# EAGLE design workshop-atmega8 (EAGLE 6.3)
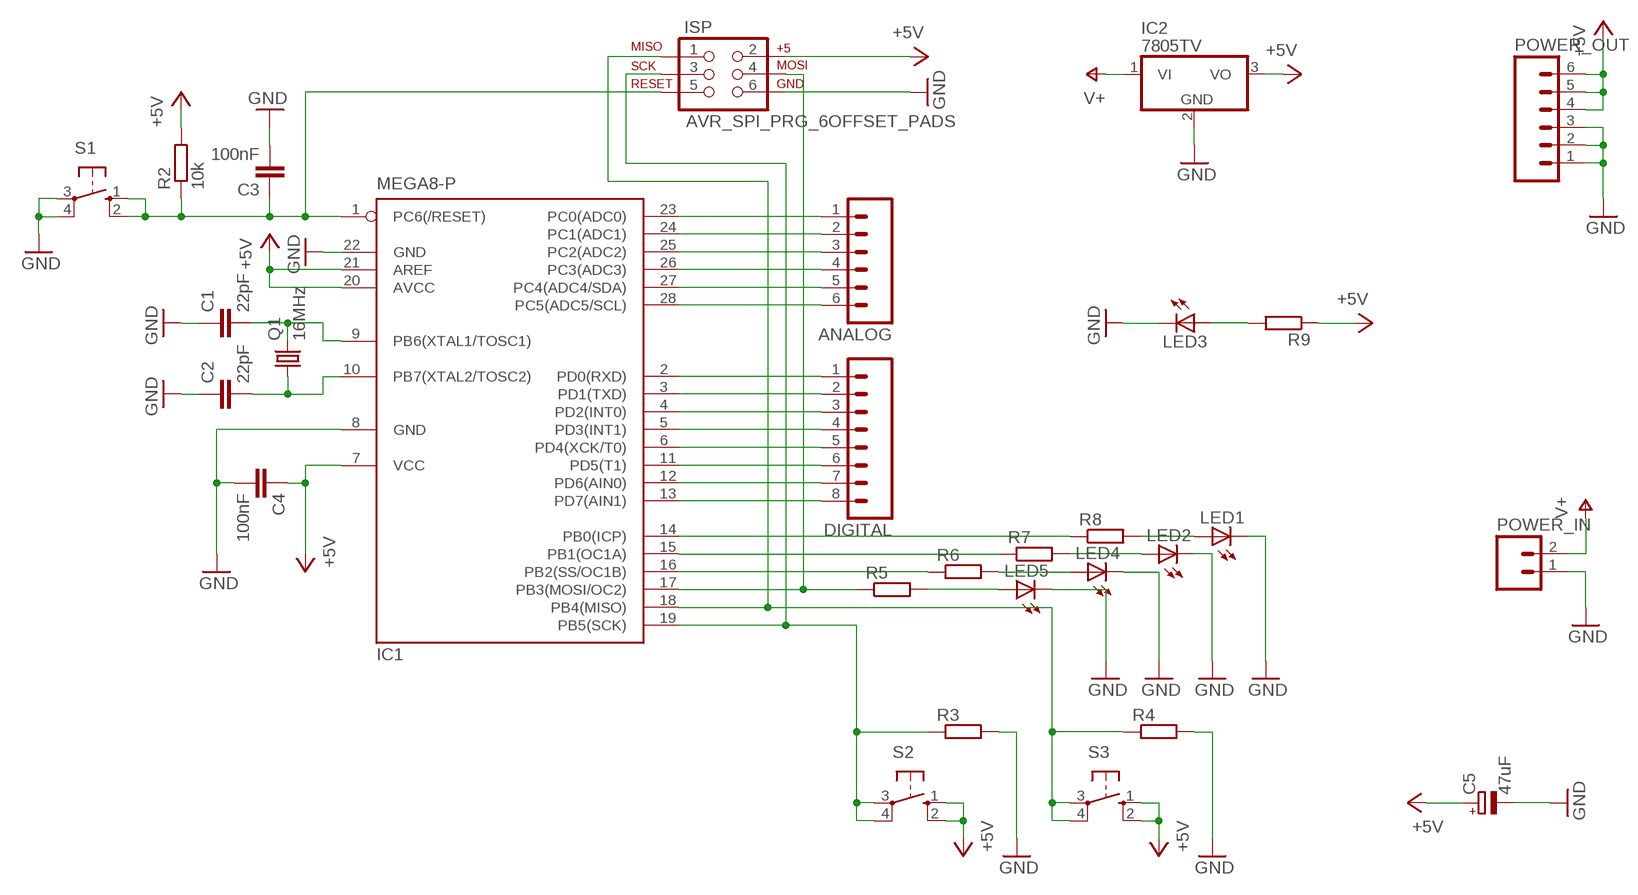
[diagram p0: schematic, sheet 1]

## Parts
ANALOG  M06LOCK_LONGPADS  [1X06_LOCK_LONGPADS]
C1  22pF  C-EU025-025X050  [C025-025X050]
C2  22pF  C-EU025-025X050  [C025-025X050]
C3  100nF  C-EU025-025X050  [C025-025X050]
C4  100nF  C-EU025-025X050  [C025-025X050]
C5  47uF  CPOL-EUE2.5-7  [E2,5-7]
DIGITAL  M08LOCK_LONGPADS  [1X08_LOCK_LONGPADS]
IC1  MEGA8-P  [DIL28-3]
IC2  7805TV  [TO220V]
ISP  AVR_SPI_PRG_6OFFSET_PADS  [2X3_OFFSET]
LED1  LED5MM  [LED5MM]
LED2  LED5MM  [LED5MM]
LED3  LED5MM  [LED5MM]
LED4  LED5MM  [LED5MM]
LED5  LED5MM  [LED5MM]
POWER_IN  M02LOCK_LONGPADS  [1X02_LOCK_LONGPADS]
POWER_OUT  M06LOCK_LONGPADS  [1X06_LOCK_LONGPADS]
Q1  16MHz  CRYSTALHC49S  [HC49/S]
R2  10k  R-EU_0207/10  [0207/10]
R3  R-EU_0207/10  [0207/10]
R4  R-EU_0207/10  [0207/10]
R5  R-EU_0207/10  [0207/10]
R6  R-EU_0207/10  [0207/10]
R7  R-EU_0207/10  [0207/10]
R8  R-EU_0207/10  [0207/10]
R9  R-EU_0207/10  [0207/10]
S1  10-XX  [B3F-10XX]
S2  10-XX  [B3F-10XX]
S3  10-XX  [B3F-10XX]

## Nets
+5V: C4.1 C5.+ IC1.7(VCC) IC1.20(AVCC) IC1.21(AREF) IC2.3(VO) ISP.2 POWER_OUT.4 POWER_OUT.5 POWER_OUT.6 R2.2 R9.1 S2.1(S) S2.2(S1) S3.1(S) S3.2(S1)
GND: C1.1 C2.1 C3.2 C4.2 C5.- IC1.8(GND) IC1.22(GND) IC2.2(GND) ISP.6 LED1.K(C) LED2.K(C) LED3.K(C) LED4.K(C) LED5.K(C) POWER_IN.1 POWER_OUT.1 POWER_OUT.2 POWER_OUT.3 R3.2 R4.2 S1.3(P) S1.4(P1)
N$1: C1.2 IC1.9(PB6(XTAL1/TOSC1)) Q1.2
N$2: C2.2 IC1.10(PB7(XTAL2/TOSC2)) Q1.1
N$3: C3.1 IC1.1(PC6(/RESET)) ISP.5 R2.1 S1.1(S) S1.2(S1)
N$5: IC1.17(PB3(MOSI/OC2)) ISP.4 R5.1
N$6: LED3.A R9.2
N$7: LED1.A R8.2
N$8: ANALOG.1 IC1.23(PC0(ADC0))
N$9: ANALOG.2 IC1.24(PC1(ADC1))
N$10: ANALOG.3 IC1.25(PC2(ADC2))
N$11: ANALOG.4 IC1.26(PC3(ADC3))
N$12: ANALOG.5 IC1.27(PC4(ADC4/SDA))
N$13: ANALOG.6 IC1.28(PC5(ADC5/SCL))
N$14: LED2.A R7.2
N$15: IC1.18(PB4(MISO)) ISP.1 R4.1 S3.3(P) S3.4(P1)
N$16: IC1.15(PB1(OC1A)) R7.1
N$17: IC1.14(PB0(ICP)) R8.1
N$18: LED4.A R6.2
N$19: DIGITAL.1 IC1.2(PD0(RXD))
N$20: LED5.A R5.2
N$21: DIGITAL.2 IC1.3(PD1(TXD))
N$23: IC1.19(PB5(SCK)) ISP.3 R3.1 S2.3(P) S2.4(P1)
N$24: DIGITAL.3 IC1.4(PD2(INT0))
N$25: DIGITAL.4 IC1.5(PD3(INT1))
N$26: DIGITAL.5 IC1.6(PD4(XCK/T0))
N$27: DIGITAL.6 IC1.11(PD5(T1))
N$28: DIGITAL.7 IC1.12(PD6(AIN0))
N$29: DIGITAL.8 IC1.13(PD7(AIN1))
N$32: IC1.16(PB2(SS/OC1B)) R6.1
V+: IC2.1(VI) POWER_IN.2

## Library data of the parts
ANALOG POWER_OUT = SparkFun:M06: Header 6 Standard 6-pin 0.1" header. Use with straight break away headers (SKU : PRT-00116), right angle break away headers (PRT-00553), swiss pins (PRT-00743), machine pins (PRT-00117), and female headers (PRT-00115). Molex polarized connector foot print use with SKU : PRT-08094 with associated crimp pins and housings. NOTES ON THE VARIANTS LOCK and LOCK_LONGPADS... This footprint was designed to help hold the alignment of a through-hole component (i.e. 6-pin header) while soldering it into place. You may notice that each hole has been shifted either up or down by 0.005 of an inch from it's more standard position (which is a perfectly straight line). This slight alteration caused the pins (the squares in the middle) to touch the edges of the holes. Because they are alternating, it causes a "brace" to hold the component in place. 0.005 has proven to be the perfect amount of "off-center" position when using our standard breakaway headers. Although looks a little odd when you look at the bare footprint, once you have a header in there, the alteration is very hard to notice. Also, if you push a header all the way into place, it is covered up entirely on the bottom side. This idea of altering the position of holes to aid alignment will be further integrated into the Sparkfun Library for other footprints. It can help hold any component with 3 or more connection pins.
C1-C4 = rcl:C-EU: CAPACITOR, European symbol
C5 = rcl:CPOL-EU: POLARIZED CAPACITOR, European symbol
DIGITAL = SparkFun:M08: Header 8 Standard 8-pin 0.1" header. Use with straight break away headers (SKU : PRT-00116), right angle break away headers (PRT-00553), swiss pins (PRT-00743), machine pins (PRT-00117), and female headers (PRT-00115).
IC1 = atmel:MEGA8-P: MICROCONTROLLER 8 Kbytes FLASH, 1 kbytes SRAM, 512 bytes EEPROM, USART, 4-channel 10 bit ADC, 2-channel 8 bit ADC Pin compatible with Atmega48, ATMega88, ATMega168 Source: avr.lbr; OC_FARNELL: unknown; OC_NEWARK: unknown
IC2 = linear:78*: Positive VOLTAGE REGULATOR Source: http://cache.national.com/ds/LM/LM78L05.pdf http://www.fairchildsemi.com/ds/LM/LM7805.pdf
ISP = SparkFun:AVR_SPI_PRG_6: AVR ISP 6 Pin This is the reduced ISP connector for AVR programming. Common on Arduino. This footprint will take up less PCB space and can be used with a 10-pin to 6-pin adapter such as SKU: BOB-08508
LED1-LED5 = led:LED: LED OSRAM: - CHIPLED LG R971, LG N971, LY N971, LG Q971, LY Q971, LO R971, LY R971 LH N974, LH R974 LS Q976, LO Q976, LY Q976 LO Q996 - Hyper CHIPLED LW Q18S LB Q993, LB Q99A, LB R99A - SideLED LS A670, LO A670, LY A670, LG A670, LP A670 LB A673, LV A673, LT A673, LW A673 LH A674 LY A675 LS A676, LA A676, LO A676, LY A676, LW A676 LS A679, LY A679, LG A679 - Hyper Micro SIDELED® LS Y876, LA Y876, LO Y876, LY Y876 LT Y87S - SmartLED LW L88C, LW L88S LB L89C, LB L89S, LG L890 LS L89K, LO L89K, LY L89K LS L896, LA L896, LO L896, LY L896 - TOPLED LS T670, LO T670, LY T670, LG T670, LP T670 LSG T670, LSP T670, LSY T670, LOP T670, LYG T670 LG T671, LOG T671, LSG T671 LB T673, LV T673, LT T673, LW T673 LH T674 LS T676, LA T676, LO T676, LY T676, LB T676, LH T676, LSB T676, LW T676 LB T67C, LV T67C, LT T67C, LS T67K, LO T67K, LY T67K, LW E67C LS E67B, LA E67B, LO E67B, LY E67B, LB E67C, LV E67C, LT E67C LW T67C LS T679, LY T679, LG T679 LS T770, LO T770, LY T770, LG T770, LP T770 LB T773, LV T773, LT T773, LW T773 LH T774 LS E675, LA E675, LY E675, LS T675 LS T776, LA T776, LO T776, LY T776, LB T776 LHGB T686 LT T68C, LB T68C - Hyper Mini TOPLED® LB M676 - Mini TOPLED Santana® LG M470 LS M47K, LO M47K, LY M47K Source: http://www.osram.convergy.de LUXEON: - LUMILED® LXK2-PW12-R00, LXK2-PW12-S00, LXK2-PW14-U00, LXK2-PW14-V00 LXK2-PM12-R00, LXK2-PM12-S00, LXK2-PM14-U00 LXK2-PE12-Q00, LXK2-PE12-R00, LXK2-PE12-S00, LXK2-PE14-T00, LXK2-PE14-U00 LXK2-PB12-K00, LXK2-PB12-L00, LXK2-PB12-M00, LXK2-PB14-N00, LXK2-PB14-P00, LXK2-PB14-Q00 LXK2-PR12-L00, LXK2-PR12-M00, LXK2-PR14-Q00, LXK2-PR14-R00 LXK2-PD12-Q00, LXK2-PD12-R00, LXK2-PD12-S00 LXK2-PH12-R00, LXK2-PH12-S00 LXK2-PL12-P00, LXK2-PL12-Q00, LXK2-PL12-R00 Source: www.luxeon.com KINGBRIGHT: KA-3528ASYC Source: www.kingbright.com
POWER_IN = SparkFun:M02: Header 2 Standard 2-pin 0.1" header. Use with straight break away headers (SKU : PRT-00116), right angle break away headers (PRT-00553), swiss pins (PRT-00743), machine pins (PRT-00117), and female headers (PRT-00115). Molex polarized connector foot print use with SKU : PRT-08233 with associated crimp pins and housings.
Q1 = crystal:CRYSTAL: CRYSTAL; OC_FARNELL: 1667008; OC_NEWARK: unknown
R2-R9 = rcl:R-EU_: RESISTOR, European symbol
S1-S3 = switch-omron:10-XX: OMRON SWITCH; MPN: B3F-1000; OC_FARNELL: 176432; OC_NEWARK: 36M3542

## Board
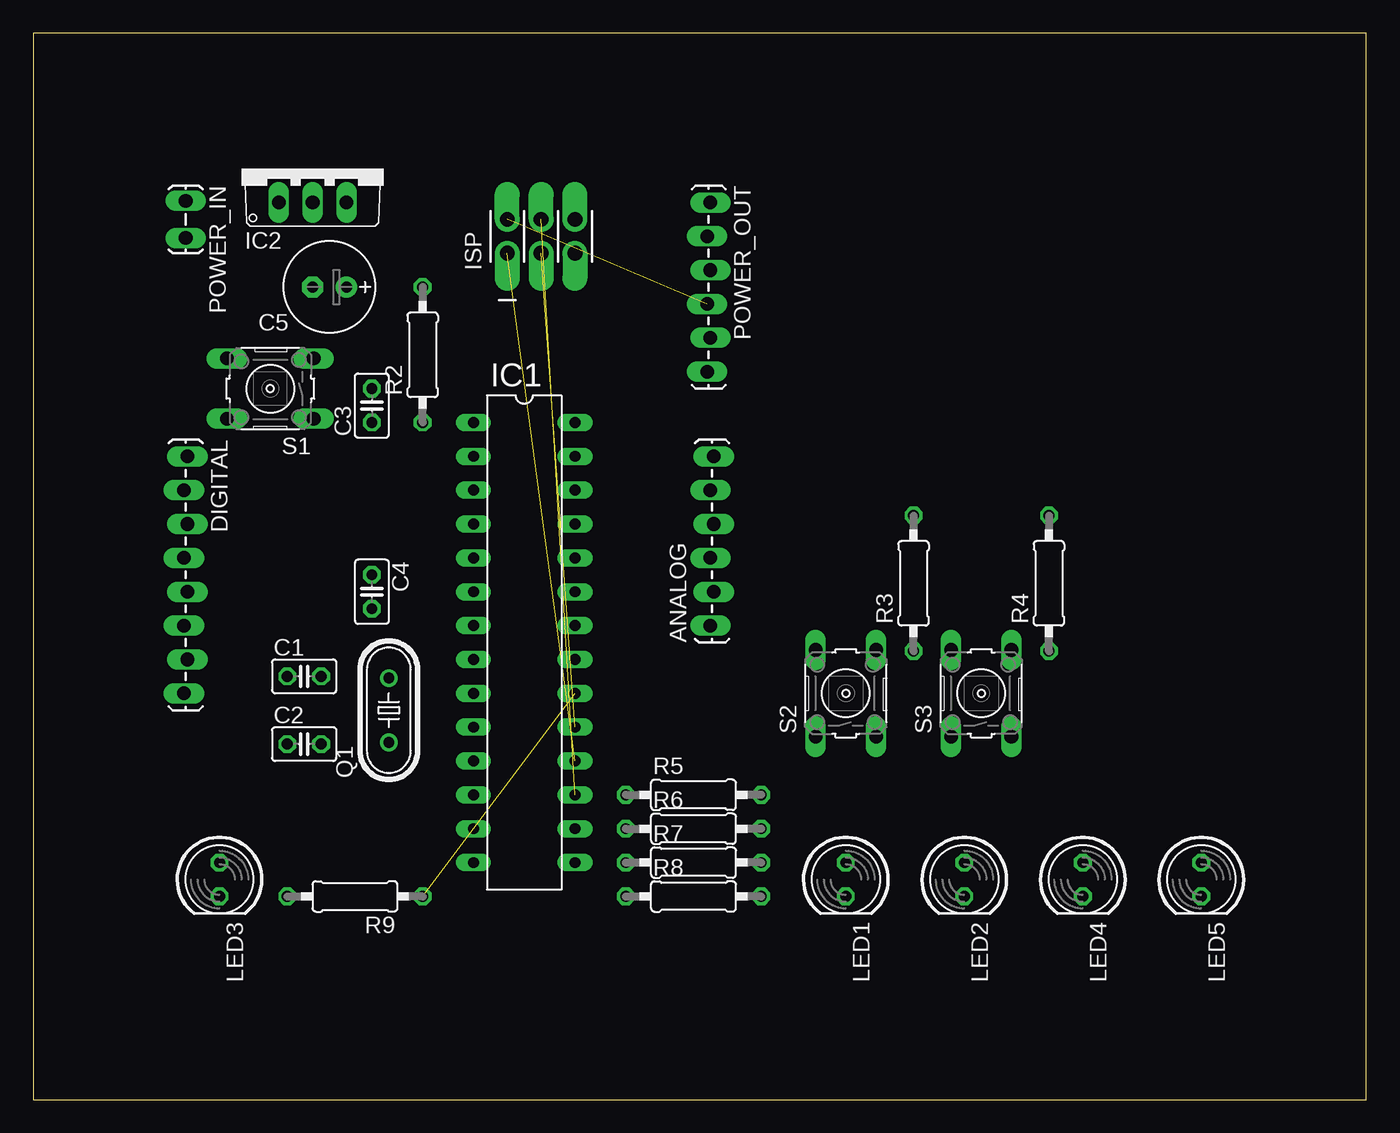
[diagram p1: board, top side]
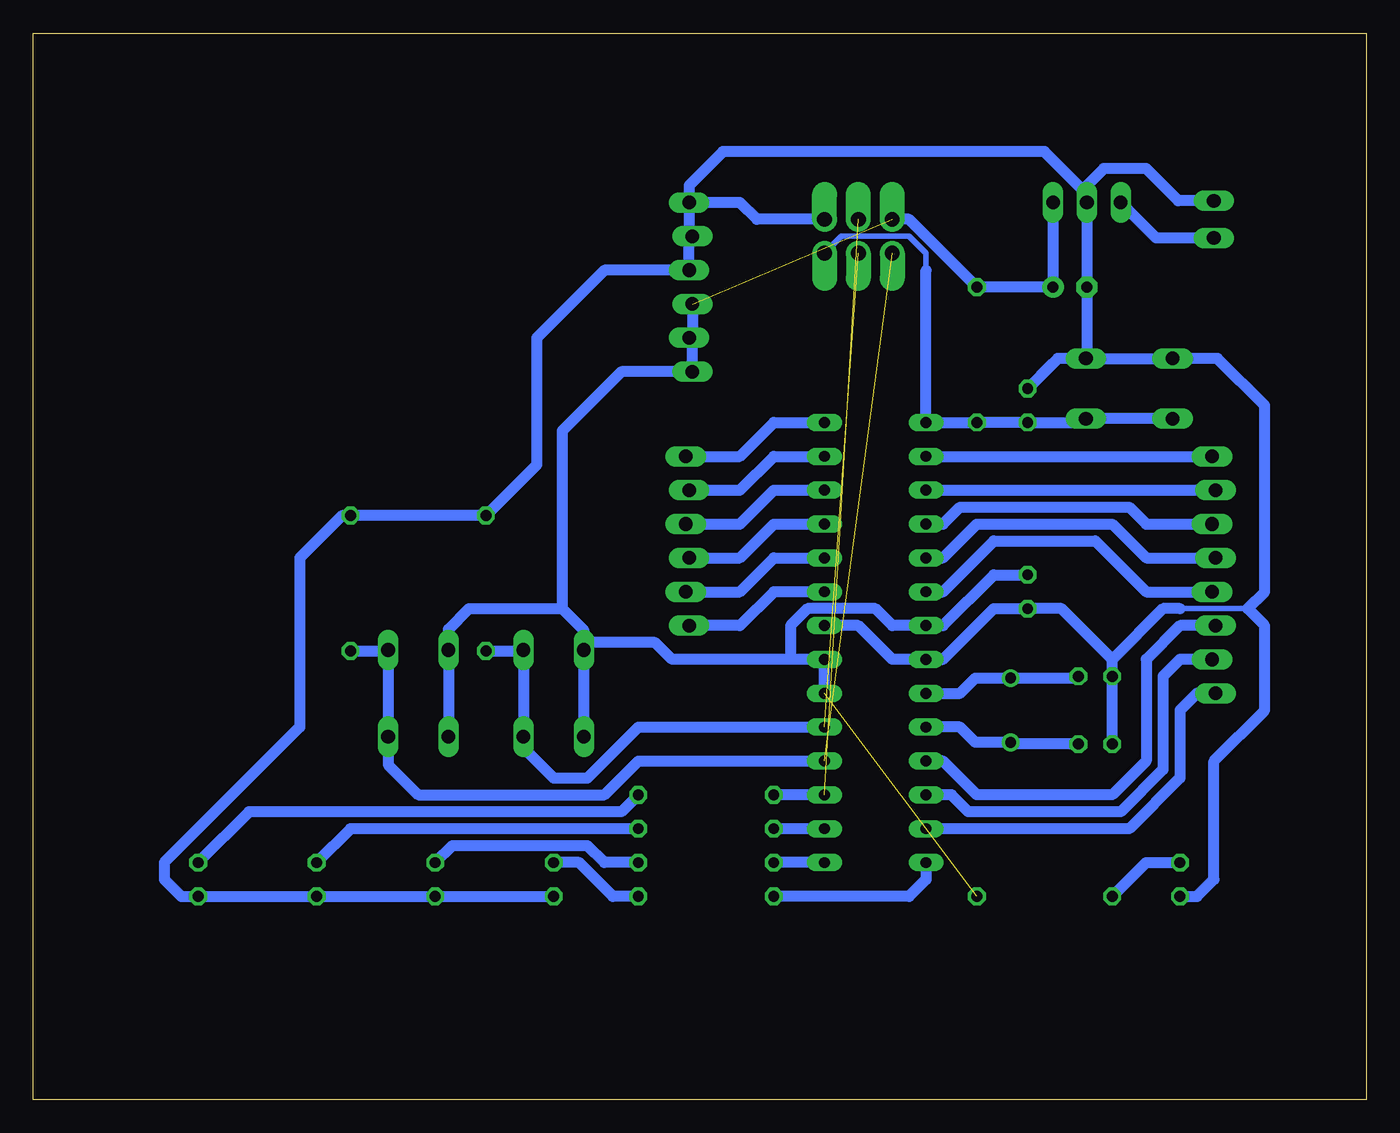
[diagram p2: board, bottom side, seen from below]

Size 100 x 80 mm. Coordinates in mm from the lower left corner, seen from the top.
Outline: 0,0 100,0 100,80 0,80 0,0
Copper layers (1*16): Top 0.035mm / dielectric 1.5mm / Bottom 0.035mm
Design rules "default": minimum track width 10mil, minimum drill 24mil, track to track 8mil, track to pad 8mil, pad to pad 8mil, via to via 8mil, smd to smd 8mil, copper to edge 40mil, drill to drill 8mil, minimum pad ring 10mil, minimum via ring 8mil, stop-mask expansion 4mil, vias tented up to drill 0mil, thermal gap 10mil

### Footprints (pad centres in the part's own frame; a part is rotated, then mirrored left to right if it is on the bottom)
1X06_LOCK_LONGPADS = drill 1.016 long: 1 0,0; 2 2.54,-0.254; 3 5.08,0; 4 7.62,-0.254; 5 10.16,0; 6 12.7,-0.254
C025-025X050 = drill 0.813 octagon: 1 -1.27,0; 2 1.27,0
E2,5-7 = drill 0.813 pad 1.6: + -1.27,0 | drill 0.813 pad 1.6 octagon: - 1.27,0
1X08_LOCK_LONGPADS = drill 1.016 long: 1 0,0.127; 2 2.54,-0.127; 3 5.08,0.127; 4 7.62,-0.127; 5 10.16,0.127; 6 12.7,-0.127; 7 15.24,0.127; 8 17.78,-0.127
DIL28-3 = drill 0.813 long: 1 -16.51,-3.81; 2 -13.97,-3.81; 3 -11.43,-3.81; 4 -8.89,-3.81; 5 -6.35,-3.81; 6 -3.81,-3.81; 7 -1.27,-3.81; 8 1.27,-3.81; 9 3.81,-3.81; 10 6.35,-3.81; 11 8.89,-3.81; 12 11.43,-3.81; 13 13.97,-3.81; 14 16.51,-3.81; 15 16.51,3.81; 16 13.97,3.81; 17 11.43,3.81; 18 8.89,3.81; 19 6.35,3.81; 20 3.81,3.81; 21 1.27,3.81; 22 -1.27,3.81; 23 -3.81,3.81; 24 -6.35,3.81; 25 -8.89,3.81; 26 -11.43,3.81; 27 -13.97,3.81; 28 -16.51,3.81
TO220V = drill 1.016 long: 1 -2.54,-2.54; 2 0,-2.54; 3 2.54,-2.54
2X3_OFFSET = drill 1.118 pad 1.88 offset: 1 -2.54,-1.27; 2 -2.54,1.27; 3 0,-1.27; 4 0,1.27; 5 2.54,-1.27; 6 2.54,1.27
LED5MM = drill 0.813 octagon: A -1.27,0; K 1.27,0
1X02_LOCK_LONGPADS = drill 1.016 long: 1 -0.127,0; 2 2.667,0
HC49/S = drill 0.813: 1 -2.413,0; 2 2.413,0
0207/10 = drill 0.813 octagon: 1 -5.08,0; 2 5.08,0
B3F-10XX = drill 1.016 long: 1 -3.251,2.261; 2 3.251,2.261; 3 -3.251,-2.261; 4 3.251,-2.261

### Placement (x,y rotation side)
ANALOG  50.8,35.56 90 top
C1  20.32,31.75 0 top
C2  20.32,26.67 0 top
C3  25.4,52.07 90 top
C4  25.4,38.1 270 top
C5  22.23,60.96 180 top
DIGITAL  11.43,48.26 270 top
IC1  36.83,34.29 270 top
IC2  20.95,69.85 0 top
ISP  38.1,64.77 0 top
LED1  60.96,16.51 270 top
LED2  69.85,16.51 270 top
LED3  13.97,16.51 270 top
LED4  78.74,16.51 270 top
LED5  87.63,16.51 270 top
POWER_IN  11.43,67.31 270 top
POWER_OUT  50.8,67.31 270 top
Q1  26.67,29.21 90 top
R2  29.21,55.88 90 top
R3  66.04,38.73 90 top
R4  76.2,38.73 90 top
R5  49.53,22.86 0 top
R6  49.53,20.32 0 top
R7  49.53,17.78 0 top
R8  49.53,15.24 0 top
R9  24.13,15.24 180 top
S1  17.78,53.34 180 top
S2  60.96,30.48 90 top
S3  71.12,30.48 90 top

### Tracks (layer width: path | path; a pad name or v marks a point on that pad's centre or on a via)
+5V  (2 unrouted)
  Bottom 0.813: C4.1 27.94,39.37 31.75,35.56 IC1.7 35.56,35.56 36.83,36.83 41.91,36.83 43.18,35.56 43.18,33.02 | S3.1 S3.2 68.86,35.28 67.31,36.83 60.33,36.83 | S2.1 S2.2 58.7,34.29 | IC2.3 C5.+ R2.2 34.29,66.04 ISP.2 | IC1.20 IC1.21 43.18,33.02 | POWER_OUT.4 50.55,57.4 POWER_OUT.5 50.55,56.9 POWER_OUT.6 55.88,54.61 60.33,50.16 60.33,36.83 | 58.7,34.29 58.7,35.2 60.33,36.83 | 43.18,33.02 52.07,33.02 53.34,34.29 58.7,34.29
GND
  Bottom 0.406: 8.89,36.83 13.97,36.83
  Bottom 0.813: LED1.K LED2.K LED4.K LED5.K 88.9,15.24 90.17,16.51 90.17,17.78 80.01,27.94 80.01,40.64 76.83,43.81 R4.2 R3.2 62.23,47.62 62.23,57.15 57.15,62.23 POWER_OUT.3 50.8,64.52 POWER_OUT.2 50.8,65.02 POWER_OUT.1 | S1.3 S1.4 11.15,55.6 7.62,52.07 7.62,38.1 8.89,36.83 7.62,35.56 7.62,29.21 11.43,25.4 11.43,16.51 12.7,15.24 LED3.K | S1.3 23.14,55.6 C3.2 23.5,55.24 | 19.05,33.02 C1.1 C2.1 | 19.05,33.02 22.86,36.83 C4.2 27.94,36.83 31.75,33.02 IC1.8 35.56,33.02 38.1,35.56 IC1.22 | S1.3 20.95,55.6 C5.- IC2.2 | POWER_IN.1 14.1,67.44 16.51,69.85 19.68,69.85 20.95,68.58 IC2.2 | 13.97,36.83 15.24,36.83 19.05,33.02 | ISP.6 45.72,66.04 46.99,67.31 POWER_OUT.1 | IC2.2 20.95,67.94 24.13,71.12 48.26,71.12 50.8,68.58 POWER_OUT.1
N$1
  Bottom 0.813: C1.2 21.72,31.62 Q1.2 29.34,31.62 30.48,30.48 IC1.9
N$2
  Bottom 0.813: C2.2 26.54,26.67 Q1.1 29.34,26.8 30.48,27.94 IC1.10
N$3
  Bottom 0.406: 33.02,62.23 33.02,63.5 34.29,64.77 39.37,64.77 ISP.5
  Bottom 0.813: S1.2 S1.1 arc90 21.31,50.8 C3.1 R2.1 IC1.1 33.02,62.23
N$5  (1 unrouted)
  Bottom 0.813: IC1.17 R5.1
N$6
  Bottom 0.813: R9.2 16.51,17.78 LED3.A
N$7
  Bottom 0.813: R8.2 56.52,15.24 59.05,17.78 LED1.A
N$8
  Bottom 0.813: IC1.23 44.45,38.1 46.99,35.56 ANALOG.1
N$9
  Bottom 0.813: ANALOG.2 46.99,38.1 44.45,40.64 IC1.24
N$10
  Bottom 0.813: ANALOG.3 46.99,40.64 44.45,43.18 IC1.25
N$11
  Bottom 0.813: ANALOG.4 46.99,43.18 44.45,45.72 IC1.26
N$12
  Bottom 0.813: ANALOG.5 46.99,45.72 44.45,48.26 IC1.27
N$13
  Bottom 0.813: ANALOG.6 46.99,48.26 44.45,50.8 IC1.28
N$14
  Bottom 0.813: R7.2 57.15,17.78 58.42,19.05 68.58,19.05 LED2.A
N$15  (1 unrouted)
  Bottom 0.813: IC1.18 54.61,25.4 57.15,22.86 71.12,22.86 73.38,25.12 S3.3 S3.4 73.46,33.66 R4.1
N$16
  Bottom 0.813: IC1.15 R7.1
N$17
  Bottom 0.813: IC1.14 33.02,16.51 34.29,15.24 R8.1
N$18
  Bottom 0.813: R6.2 76.2,20.32 LED4.A
N$19
  Bottom 0.813: IC1.2 DIGITAL.1
N$20
  Bottom 0.813: R5.2 55.88,21.59 83.82,21.59 LED5.A
N$21
  Bottom 0.813: IC1.3 DIGITAL.2
N$23  (1 unrouted)
  Bottom 0.813: S2.4 63.22,33.02 | 63.22,33.02 S2.3 63.22,26.39 60.96,24.13 58.42,24.13 54.61,27.94 IC1.19 | R3.1 63.86,33.66 63.22,33.02
N$24
  Bottom 0.813: IC1.4 31.75,43.18 30.48,44.45 17.78,44.45 16.51,43.18 DIGITAL.3
N$25
  Bottom 0.813: IC1.5 31.75,40.64 29.21,43.18 19.05,43.18 16.51,40.64 DIGITAL.4
N$26
  Bottom 0.813: IC1.6 31.75,38.1 27.94,41.91 20.32,41.91 16.51,38.1 DIGITAL.5
N$27
  Bottom 0.813: DIGITAL.6 13.97,35.56 16.51,33.02 16.51,25.4 19.05,22.86 29.21,22.86 31.75,25.4 IC1.11
N$28
  Bottom 0.813: DIGITAL.7 13.97,33.02 15.24,31.75 15.24,24.77 18.41,21.59 29.84,21.59 31.11,22.86 IC1.12
N$29
  Bottom 0.813: DIGITAL.8 12.7,30.48 13.97,29.21 13.97,24.13 17.78,20.32 IC1.13
N$32
  Bottom 0.813: IC1.16 R6.1
V+
  Bottom 0.813: POWER_IN.2 15.75,64.64 IC2.1